# Altium project aymed_balloon.PrjPcb
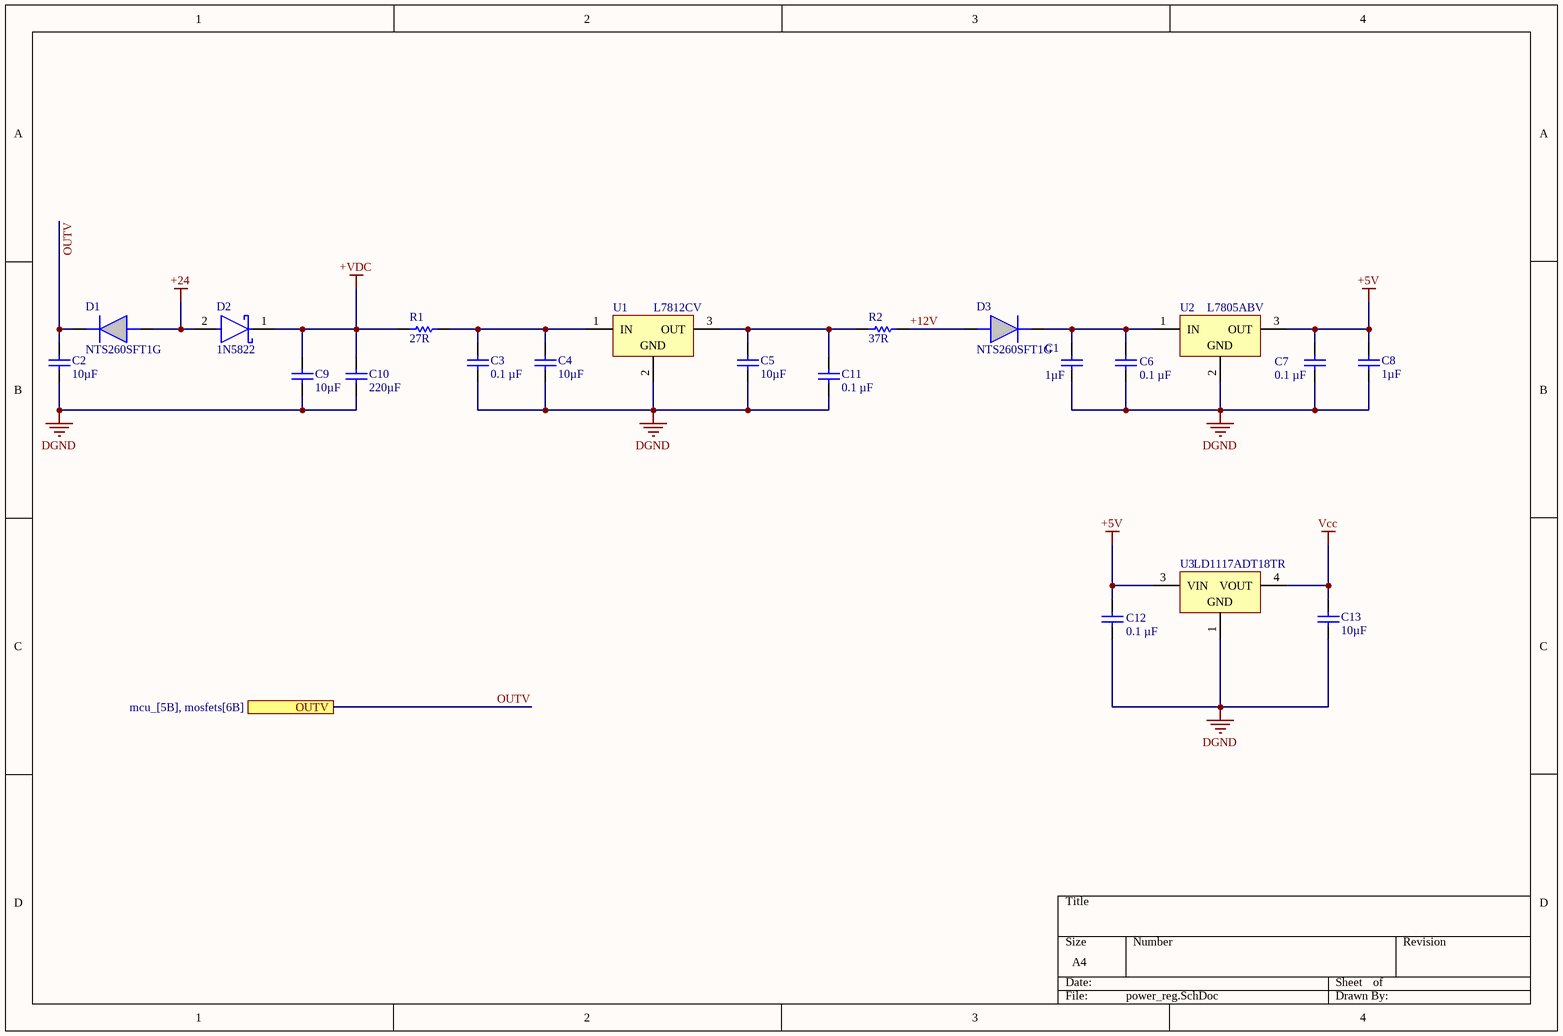
[diagram p0: power_reg.SchDoc]
3 sheets, 116 parts. Net scope: flat (ports and power ports of the same name join across sheets).
Board file: pcb.PcbDoc
Sheets:
  power_reg.SchDoc
  mcu_.SchDoc
  mosfets.SchDoc

## Sheet power_reg.SchDoc
size A4; SheetNumber: 1; SheetTotal: 3

### Parts
C1  Capacitance: 1µF  [0603cap]  (hidden comment: CAP CER 1UF 25V X7R 0603)
C2  Capacitance: 10µF  [CAPC2012X140N - duplicate]  (hidden comment: CAP CER 10UF 25V X5R 0805)
C3  Capacitance: 0.1 µF  [0603cap]  (hidden comment: CAP CER 0.1UF 25V X7R 0603)
C4  Capacitance: 10µF  [0603cap]  (hidden comment: CAP CER 10UF 25V X5R 0805)
C5  Capacitance: 10µF  [CAPC2012X140N - duplicate]  (hidden comment: CAP CER 10UF 25V X5R 0805)
C6  Capacitance: 0.1 µF  [0603cap]  (hidden comment: CAP CER 0.1UF 25V X7R 0603)
C7  Capacitance: 0.1 µF  [0603cap]  (hidden comment: CAP CER 0.1UF 25V X7R 0603)
C8  Capacitance: 1µF  [0603cap]  (hidden comment: CAP CER 1UF 25V X7R 0603)
C9  Capacitance: 10µF  [CAPC2012X140N - duplicate]  (hidden comment: CAP CER 10UF 25V X5R 0805)
C10  Capacitance: 220µF  [CAPC2012X140N - duplicate]  (hidden comment: CAP CER 10UF 25V X5R 0805)
C11  Capacitance: 0.1 µF  [0603cap]  (hidden comment: CAP CER 0.1UF 25V X7R 0603)
C12  Capacitance: 0.1 µF  [0603cap]  (hidden comment: CAP CER 0.1UF 25V X7R 0603)
C13  Capacitance: 10µF  [CAPC2012X140N]  (hidden comment: CAP CER 10UF 25V X5R 0805)
D1  NTS260SFT1G  [SODFL3616X98N]
D2  1N5822  [FP-DO-201AD-MFG]
D3  NTS260SFT1G  [SODFL3616X98N]
R1  Resistance: 27R  [0603 RES]  (hidden comment: RC0603JR-0727RL)
R2  Resistance: 37R  [0603 RES]  (hidden comment: RC0603JR-0727RL)
U1  L7812CV  [TO220]
U2  L7805ABV  [TO220]
U3  LD1117ADT18TR  [TO-252_N]

### Ports
OUTV (see mcu_[5B], mosfets[6B])

### Nets
+5V: C7.2 C8.2 C12.2 U2.3(OUT) U3.3(VIN)
+24: D1.2(A) D2.2(A)
+VDC: C9.2 C10.2 D2.1(C) R1.1
DGND: C1.1 C2.1 C3.1 C4.1 C5.1 C6.1 C7.1 C8.1 C9.1 C10.1 C11.1 C12.1 C13.1 U1.2(GND) U2.2(GND) U3.1(GND)  [project net MCU_BZR]
Vcc: C13.2 U3.4(VOUT)  [project net +3V3]
+12V: D3.2(A) R2.1
OUTV: C2.2 D1.1(K) ; port OUTV
NetC1_2: C1.2 C6.2 D3.1(K) U2.1(IN)
NetC3_2: C3.2 C4.2 R1.2 U1.1(IN)
NetC5_2: C5.2 C11.2 R2.2 U1.3(OUT)

### Library data of the parts
C1 C8 = CAP CER 1UF 25V X7R 0603: 1 µF ±10% 25V Ceramic Capacitor X7R 0603 (1608 Metric); Manufacturer: Samsung Electro-Mechanics; Manufacturer PN: CL10B105KA8NNNC; Supplier PN: 1276-1184-1-ND; Supplier: Digikey; Supplier 1: Digi-Key; Supplier Part Number 1: 1276-1184-1-ND
C2 C4 C5 C9 C10 C13 = CAP CER 10UF 25V X5R 0805: 10 µF ±20% 25V Ceramic Capacitor X5R 0805 (2012 Metric); Supplier 1: Digi-Key; Supplier Part Number 1: 490-10748-1-ND
C3 C6 C7 C11 C12 = CAP CER 0.1UF 25V X7R 0603: 0.1 µF ±5% 25V Ceramic Capacitor X7R 0603 (1608 Metric); Manufacturer PN: C0603C104J3RACAUTO; Supplier 1: Digi-Key; Supplier Part Number 1: 399-12996-1-ND; Supplier PN: 399-12996-1-ND
D1 D3 = NTS260SFT1G: Fine Lithography Trenchbased Schottky Technology for Very Low Forward Voltage and Low Leakage; Fast Switching with Exceptional Temperature Stability; Low Power Loss and Lower Operating Temperature; Higher Efficiency for Achieving Regulatory Compliance; Low Thermal Resistance; High Surge Capability; These are PbFree and HalideFree Devices; Manufacturer_Name: onsemi; Geometry.Height: 0.98mm; Manufacturer_Part_Number: NTS260SFT1G; Mouser Part Number: 863-NTS260SFT1G; Mouser Price/Stock: https://www.mouser.co.uk/ProductDetail/onsemi/NTS260SFT1G?qs=k6dkFvHqcvCML1heMZjMng%3D%3D; Arrow Part Number: NTS260SFT1G; Arrow Price/Stock: https://www.arrow.com/en/products/nts260sft1g/on-semiconductor; Datasheet Link: https://www.onsemi.com/pub/Collateral/NTS260SF-D.PDF
D2 = CMP-12187-000025-1: DIODE SCHOTTKY 40V 3A DO201AD; Manufacturer: STMicroelectronics; Max Junction Temp: +150°C; Peak Reverse Current: 2mA; Max Surge Forward Current: 80A; Temperature Range High: +150°C; Automotive: No; RoHS: TRUE; ComponentLink2Description: Datasheet; Manufacturer Part Number: 1N5822; Lead Free: Yes; Octopart: https://octopart.com/1n5822-stmicroelectronics-323225; Device Class L2: Diodes; Max Repetitive Reverse Voltage: 40V; Temperature: to +150°C; Height: 5.3mm; Category: Diode; Digikey Description: DIODE SCHOTTKY 40V 3A DO201AD; ComponentLink2URL: https://www.st.com/resource/en/datasheet/1n5822.pdf; Device Class L3: Schottky Diodes; Device Class L1: Discrete Semiconductors; Forward Current: 3A; Mouser Description: Schottky Diodes & Rectifiers Vr/40V Io/3A BULK; Package: DO-201AD
R1 R2 = RES 27 OHM 5% 1/10W 0603: Manufacturer: YAGEO; Supplier PN: 311-27GRCT-ND; Supplier: DIGIKEY; ComponentLink1Description: Supplier Link; ComponentLink1URL: 0R; Manufacturer PN: RC0603JR-0727RL; Supplier 1: Digi-Key; Supplier Part Number 1: 311-27GRCT-ND
U1 = CMP-0244-00450-1: Positive Voltage Regulator, 12V, 3-Pin TO-220; PackageDescription: TO, Thru-Hole, Vertical, Heatsink Mounted; 3 In-Line Leads; Pitch 2.54 mm; ComponentLink3URL: http://www.st.com/internet/com/TECHNICAL_RESOURCES/TECHNICAL_LITERATURE/PACKAGE_INFORMATION/CD00004649.pdf; ComponentLink1URL: http://www.st.com; ComponentLink2Description: Datasheet; ComponentLink3Description: Package Specification; ComponentLink2URL: http://www.st.com/internet/com/TECHNICAL_RESOURCES/TECHNICAL_LITERATURE/DATASHEET/CD00000444.pdf; DatasheetVersion: 16/11/2011; PackageVersion: ver3.0; PackageReference: TO220; ComponentLink1Description: Manufacturer URL
U2 = CMP-0244-00485-1: Positive Voltage Regulator, 5V, 3-Pin TO-220; ComponentLink1URL: http://www.st.com; PackageDescription: TO, Thru-Hole, Vertical, Heatsink Mounted; 3 In-Line Leads; Pitch 2.54 mm; DatasheetVersion: 16/11/2011; ComponentLink2Description: Datasheet; ComponentLink1Description: Manufacturer URL; PackageReference: TO220; ComponentLink3Description: Package Specification; ComponentLink2URL: http://www.st.com/internet/com/TECHNICAL_RESOURCES/TECHNICAL_LITERATURE/DATASHEET/CD00000444.pdf; ComponentLink3URL: http://www.st.com/internet/com/TECHNICAL_RESOURCES/TECHNICAL_LITERATURE/PACKAGE_INFORMATION/CD00004649.pdf; PackageVersion: ver3.0
U3 = CMP-0244-00136-1: 1A, Low Drop Positive Voltage Regulator, 1.8V, 3-Pin DPAK, Tape and Reel; DatasheetVersion: 2/12/2011; ComponentLink1Description: Manufacturer URL; ComponentLink1URL: http://www.st.com; ComponentLink2Description: Datasheet; PackageVersion: 2011; ComponentLink2URL: http://www.st.com/internet/com/TECHNICAL_RESOURCES/TECHNICAL_LITERATURE/DATASHEET/CD00002116.pdf; PackageReference: TO-252; PackageDescription: 3-Pin Transistor Outline Package 2.28 mm Pitch, 9.7 mm Lead Span (DPAK)

## Sheet mcu_.SchDoc
size A3; SheetNumber: 2; SheetTotal: 3
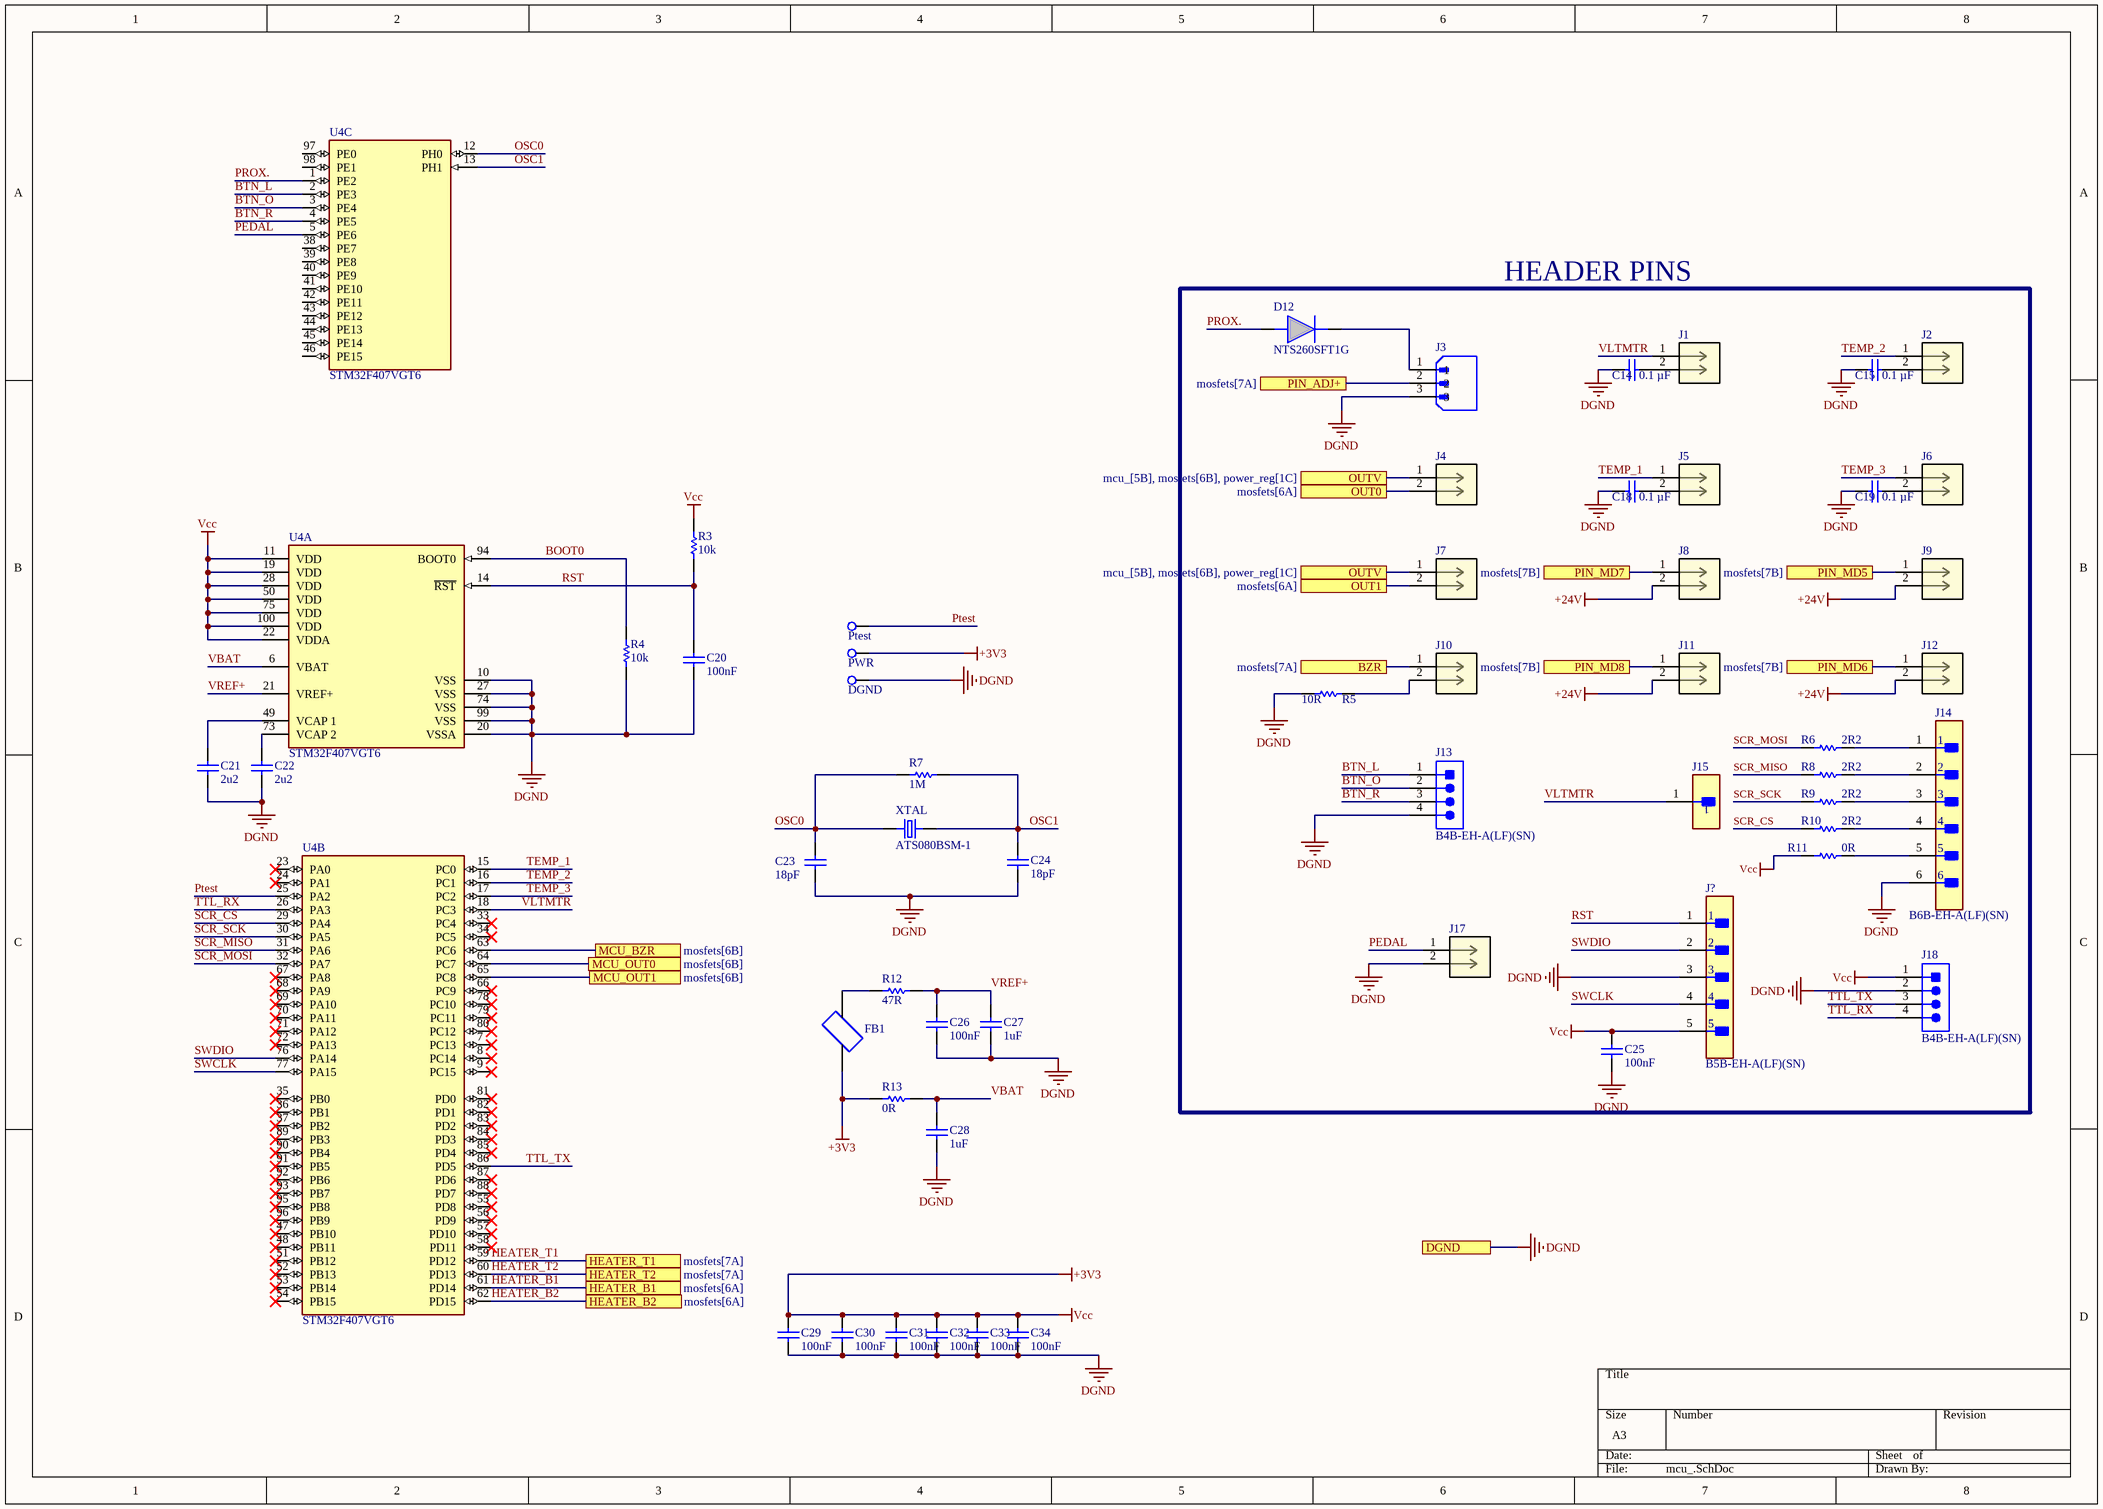
[diagram p1: mcu_.SchDoc]

### Parts
C14  Capacitance: 0.1 µF  [0603cap]  (hidden comment: CAP CER 0.1UF 25V X7R 0603)
C15  Capacitance: 0.1 µF  [0603cap]  (hidden comment: CAP CER 0.1UF 25V X7R 0603)
C18  Capacitance: 0.1 µF  [0603cap]  (hidden comment: CAP CER 0.1UF 25V X7R 0603)
C19  Capacitance: 0.1 µF  [0603cap]  (hidden comment: CAP CER 0.1UF 25V X7R 0603)
C20  Capacitance: 100nF  [0603 CAP]  (hidden comment: C0603C104K5RAC7867)
C21  Capacitance: 2u2  [0603cap]  (hidden comment: JMK107ABJ106MA-T)
C22  Capacitance: 2u2  [0603cap]  (hidden comment: JMK107ABJ106MA-T)
C23  Capacitance: 18pF  [0603 CAP]  (hidden comment: GCM1885C2A160JA16D)
C24  Capacitance: 18pF  [0603 CAP]  (hidden comment: GCM1885C2A160JA16D)
C25  Capacitance: 100nF  [0603 CAP]  (hidden comment: C0603C104K5RAC7867)
C26  Capacitance: 100nF  [0603 CAP]  (hidden comment: C0603C104K5RAC7867)
C27  Capacitance: 1uF  [0603 CAP]  (hidden comment: 1 µF ±10% 25V Ceramic Capacitor X5R 0603)
C28  Capacitance: 1uF  [0603 CAP]  (hidden comment: 1 µF ±10% 25V Ceramic Capacitor X5R 0603)
C29  Capacitance: 100nF  [0603 CAP]  (hidden comment: C0603C104K5RAC7867)
C30  Capacitance: 100nF  [0603 CAP]  (hidden comment: C0603C104K5RAC7867)
C31  Capacitance: 100nF  [0603 CAP]  (hidden comment: C0603C104K5RAC7867)
C32  Capacitance: 100nF  [0603 CAP]  (hidden comment: C0603C104K5RAC7867)
C33  Capacitance: 100nF  [0603 CAP]  (hidden comment: C0603C104K5RAC7867)
C34  Capacitance: 100nF  [0603 CAP]  (hidden comment: C0603C104K5RAC7867)
D12  NTS260SFT1G  [SODFL3616X98N]
DGND  (no value)  [TEST POINT]
FB1  BLM18AG601SN1D  [0603cap]  (value not drawn)
J1  JST CONN HEADER VERT 2POS 2.5MM  [CONN_B2B-EH-A (LF)(SN)_JST]  (value not drawn)
J2  JST CONN HEADER VERT 2POS 2.5MM  [CONN_B2B-EH-A (LF)(SN)_JST]  (value not drawn)
J3  JST CONN HEADER VERT 3POS 2.5MM  [JST_B3B-XH-A(LF)(SN)]  (value not drawn)
J4  JST CONN HEADER VERT 2POS 2.5MM  [CONN_B2B-EH-A (LF)(SN)_JST]  (value not drawn)
J5  JST CONN HEADER VERT 2POS 2.5MM  [CONN_B2B-EH-A (LF)(SN)_JST]  (value not drawn)
J6  JST CONN HEADER VERT 2POS 2.5MM  [CONN_B2B-EH-A (LF)(SN)_JST]  (value not drawn)
J7  JST CONN HEADER VERT 2POS 2.5MM  [CONN_B2B-EH-A (LF)(SN)_JST]  (value not drawn)
J8  JST CONN HEADER VERT 2POS 2.5MM  [CONN_B2B-EH-A (LF)(SN)_JST]  (value not drawn)
J9  JST CONN HEADER VERT 2POS 2.5MM  [CONN_B2B-EH-A (LF)(SN)_JST]  (value not drawn)
J10  JST CONN HEADER VERT 2POS 2.5MM  [CONN_B2B-EH-A (LF)(SN)_JST]  (value not drawn)
J11  JST CONN HEADER VERT 2POS 2.5MM  [CONN_B2B-EH-A (LF)(SN)_JST]  (value not drawn)
J12  JST CONN HEADER VERT 2POS 2.5MM  [CONN_B2B-EH-A (LF)(SN)_JST]  (value not drawn)
J13  B4B-EH-A(LF)(SN)  [JST-B4B-EH-A_V]
J14  B6B-EH-A(LF)(SN)  [FP-B6B-EH-A_LF_SN-MFG]
J15  TSW-101-07-L-S  [FP-TSW-101-07-L-S-MFG]  (value not drawn)
J17  JST CONN HEADER VERT 2POS 2.5MM  [CONN_B2B-EH-A (LF)(SN)_JST]  (value not drawn)
J18  B4B-EH-A(LF)(SN)  [JST-B4B-EH-A_V]
J?  B5B-EH-A(LF)(SN)  [FP-B5B-EH-A_LF_SN-MFG]
Ptest  (no value)  [TEST POINT]
PWR  (no value)  [TEST POINT]
R3  Resistance: 10k  [0603RES]  (hidden comment: Res  0603 10K Ohm 1% 1/10W)
R4  Resistance: 10k  [0603RES]  (hidden comment: Res  0603 10K Ohm 1% 1/10W)
R5  Resistance: 10R  [0603RES]  (hidden comment: Res  0603 10K Ohm 1% 1/10W)
R6  Resistance: 2R2  [0603RES]  (hidden comment: 2.2R Ohms Jumper Chip Resistor 0603)
R7  Resistance: 1M  [0603RES]  (hidden comment: TC0325F1004T5F)
R8  Resistance: 2R2  [0603RES]  (hidden comment: 2.2R Ohms Jumper Chip Resistor 0603)
R9  Resistance: 2R2  [0603RES]  (hidden comment: 2.2R Ohms Jumper Chip Resistor 0603)
R10  Resistance: 2R2  [0603RES]  (hidden comment: 2.2R Ohms Jumper Chip Resistor 0603)
R11  Resistance: 0R  [0603RES]  (hidden comment: 0 Ohms Jumper Chip Resistor 0603)
R12  Resistance: 47R  [0603RES]  (hidden comment: CQ03SAF470JT5E)
R13  Resistance: 0R  [0603RES]  (hidden comment: 0 Ohms Jumper Chip Resistor 0603)
U4  STM32F407VGT6  [FP-LQFP100-1L-MFG]  (parts A,B,C of 3)
XTAL  ATS080BSM-1  [ATS080BSM-1]

### Ports
BZR (see mosfets[7A]), DGND, HEATER_B1 (see mosfets[6A]), HEATER_B2 (see mosfets[6A]), HEATER_T1 (see mosfets[7A]), HEATER_T2 (see mosfets[7A]), MCU_BZR (see mosfets[6B]), MCU_OUT0 (see mosfets[6B]), MCU_OUT1 (see mosfets[6B]), OUT0 (see mosfets[6A]), OUT1 (see mosfets[6A]), OUTV (see mcu_[5B], mosfets[6B], power_reg[1C]), PIN_ADJ+ (see mosfets[7A]), PIN_MD5 (see mosfets[7B]), PIN_MD6 (see mosfets[7B]), PIN_MD7 (see mosfets[7B]), PIN_MD8 (see mosfets[7B])

### Nets
+3V3: C25.1 C29.1 C30.1 C31.1 C32.1 C33.1 C34.1 FB1.1 J18.1 J?.5 PWR.1(TP) R3.2 R11.1 R13.1 U4.11(VDD) U4.19(VDD) U4.22(VDDA) U4.28(VDD) U4.50(VDD) U4.75(VDD) U4.100(VDD)  [also labelled Vcc]
\: J4.2 J7.2 J8.2 J9.2 J10.2 J11.2 J12.2 R5.1 ; port OUT0, port OUT1  [also labelled +24V]
DGND: C14.1 C15.1 C18.1 C19.1 C20.2 C21.2 C22.2 C23.2 C24.2 C25.2 C26.2 C27.2 C28.2 C29.2 C30.2 C31.2 C32.2 C33.2 C34.2 DGND.1(TP) J3.3 J13.4 J14.6 J17.2 J18.2 J?.3 R4.1 R5.2 U4.10(VSS) U4.20(VSSA) U4.27(VSS) U4.63(PC6) U4.74(VSS) U4.99(VSS) ; port MCU_BZR, port DGND  [project net MCU_BZR]
BOOT0: R4.2 U4.94(BOOT0)
BTN_L: J13.1 U4.2(PE3)
BTN_O: J13.2 U4.3(PE4)
BTN_R: J13.3 U4.4(PE5)
BZR: J10.1 ; port BZR
HEATER_B1: U4.61(PD14) ; port HEATER_B1
HEATER_B2: U4.62(PD15) ; port HEATER_B2
HEATER_T1: U4.59(PD12) ; port HEATER_T1
HEATER_T2: U4.60(PD13) ; port HEATER_T2
MCU_OUT0: U4.64(PC7) ; port MCU_OUT0
MCU_OUT1: U4.65(PC8) ; port MCU_OUT1
MD5: J9.1 ; port PIN_MD5
MD6: J12.1 ; port PIN_MD6
MD7: J8.1 ; port PIN_MD7
MD8: J11.1 ; port PIN_MD8
OSC0: C23.1 R7.2 U4.12(PH0) XTAL.1
OSC1: C24.1 R7.1 U4.13(PH1) XTAL.2
OUTV: J4.1 J7.1 ; port OUTV
PEDAL: J17.1 U4.5(PE6)
PIN_ADJ+: J3.2 ; port PIN_ADJ+
PROX.: D12.2(A) U4.1(PE2)
Ptest: Ptest.1(TP) U4.25(PA2)
RST: C20.1 J?.1 R3.1 U4.14(~{RST})
SCR_CS: R10.1 U4.29(PA4)
SCR_MISO: R8.1 U4.31(PA6)
SCR_MOSI: R6.1 U4.32(PA7)
SCR_SCK: R9.1 U4.30(PA5)
SWCLK: J?.4 U4.77(PA15)
SWDIO: J?.2 U4.76(PA14)
TEMP_1: J5.1 U4.15(PC0)
TEMP_2: J2.1 U4.16(PC1)
TEMP_3: J6.1 U4.17(PC2)
TTL_RX: J18.4 U4.26(PA3)
TTL_TX: J18.3 U4.86(PD5)
VBAT: C28.1 R13.2 U4.6(VBAT)
VLTMTR: J1.1 J15.1 U4.18(PC3)
VREF+: C26.1 C27.1 R12.1 U4.21(VREF+)
NetC14_2: C14.2 J1.2
NetC15_2: C15.2 J2.2
NetC18_2: C18.2 J5.2
NetC19_2: C19.2 J6.2
NetC21_1: C21.1 U4.49(VCAP_1)
NetC22_1: C22.1 U4.73(VCAP_2)
NetD12_1: D12.1(K) J3.1
NetFB1_2: FB1.2 R12.2
NetJ14_1: J14.1 R6.2
NetJ14_2: J14.2 R8.2
NetJ14_3: J14.3 R9.2
NetJ14_4: J14.4 R10.2
NetJ14_5: J14.5 R11.2

Not connected (* = marked no-connect by the designer): U4 7(PC13)* 8(PC14)* 9(PC15)* 23(PA0)* 24(PA1)* 33(PC4)* 34(PC5)* 35(PB0)* 36(PB1)* 37(PB2)* 38(PE7) 39(PE8) 40(PE9) 41(PE10) 42(PE11) 43(PE12) 44(PE13) 45(PE14) 46(PE15) 47(PB10)* 48(PB11)* 51(PB12)* 52(PB13)* 53(PB14)* 54(PB15)* 55(PD8)* 56(PD9)* 57(PD10)* 58(PD11)* 66(PC9)* 67(PA8)* 68(PA9)* 69(PA10)* 70(PA11)* 71(PA12)* 72(PA13)* 78(PC10)* 79(PC11)* 80(PC12)* 81(PD0)* 82(PD1)* 83(PD2)* 84(PD3)* 85(PD4)* 87(PD6)* 88(PD7)* 89(PB3)* 90(PB4)* 91(PB5)* 92(PB6)* 93(PB7)* 95(PB8)* 96(PB9)* 97(PE0) 98(PE1)

### Notes on the sheet
- HEADER PINS

### Library data of the parts
C14 C15 C18 C19 = CAP CER 0.1UF 25V X7R 0603: as C3 on sheet power_reg; Supplier 1: Digi-Key; Supplier Part Number 1: 399-12996-1-ND; Supplier PN: 399-12996-1-ND
C20 C25 C26 C29-C34 = C0603C104K5RAC7867: Ceramic Capacitors  SMD 50volts 0.1uF X7R 10%; Supplier: OZDISAN; ComponentLink1Description: Supplier Link
  C20 C25 C26 C31-C34: Supplier PN: CL10B104KB8NNNC; ComponentLink1URL: https://www.ozdisan.com/pasif-komponentler/kondansatorler/smt-smd-ve-mlcc-kondansatorler/CL10B104KB8NNNC
  C29 C30: Supplier PN: CL10A105KO8NNNC; ComponentLink1URL: https://www.ozdisan.com/pasif-komponentler/kondansatorler/smt-smd-ve-mlcc-kondansatorler/CL10A105KO8NNNC
C21 C22 = GRM188R61E225KA12D: 2.2 µF ±10% 25V Ceramic Capacitor X5R 0603; Manufacturer: Murata; Designed By: Baran; ComponentLink1Description: https://datasheet.ciiva.com/22706/1747460-22706787.pdf?src-supplier=Element14; ComponentLink1URL: https://datasheet.ciiva.com/22706/1747460-22706787.pdf?src-supplier=Element14; Supplier 1: Digi-Key; Manufacturer Part Number: GRM188R61E225KA12D; RoHS: Yes; Category: Ceramic Capacitors; Stock 1: 503975; Pricing 1: 1=0.17000, 10=0.12200, 50=0.06940, 100=0.05750, 500=0.04034, 1000=0.03339 (USD); Mount: Surface Mount; Case/Package: 0603; Number of Pins: 2; Case Code (Metric): 1608; Case Code (Imperial): 0603; Material: Ceramic; Weight: 0.000222oz; Min Operating Temperature: -55°C; Max Operating Temperature: 85°C; Tolerance: 10%; Dielectric: X5R; Voltage Rating: 25V; Packaging: Tape and Reel; Voltage: 25V; Termination: SMD/SMT; Resistor Type: Ceramic; Voltage Rating (DC): 25V; Package Quantity: 4000; Series: GRM; Construction: Flat; Length: 1.6mm; Width: 0.8mm; Height: 0.8mm; Thickness: 0.035inch; Depth: 0.8mm; Radiation Hardening: No; REACH SVHC: No SVHC; Lead Free: Lead Free; RoHS Compliant: Yes; ComponentLink2URL: https://datasheet.ciiva.com/7719/1747460-7719045.pdf?src-supplier=Element14; ComponentLink2Description: https://datasheet.ciiva.com/7719/1747460-7719045.pdf?src-supplier=Element14; ComponentLink3URL: https://datasheet.ciiva.com/14116/grmseries-highdielectrictype-eng-14116409.pdf?src-supplier=Distrelec; ComponentLink3Description: https://datasheet.ciiva.com/14116/grmseries-highdielectrictype-eng-14116409.pdf?src-supplier=Distrelec; Supplier Part Number 1: 490-10731-1-ND
C23 C24 = C0603C104K5RAC7867: 18 pF ±5% 50V Ceramic Capacitor C0G, NP0 0603 (1608 Metric); Supplier PN: CL10C180JB81PNC; Supplier: OZDISAN; ComponentLink1Description: Supplier Link; ComponentLink1URL: https://www.ozdisan.com/pasif-komponentler/kondansatorler/smt-smd-ve-mlcc-kondansatorler/CL10C180JB81PNC
C27 C28 = C0603C104K5RAC7867: Supplier PN: CL10A105KO8NNNC; Supplier: OZDISAN; ComponentLink1Description: Supplier Link; ComponentLink1URL: https://www.ozdisan.com/pasif-komponentler/kondansatorler/smt-smd-ve-mlcc-kondansatorler/CL10A105KO8NNNC
D12 = NTS260SFT1G: as D1 on sheet power_reg; Manufacturer_Part_Number: NTS260SFT1G; Mouser Part Number: 863-NTS260SFT1G; Mouser Price/Stock: https://www.mouser.co.uk/ProductDetail/onsemi/NTS260SFT1G?qs=k6dkFvHqcvCML1heMZjMng%3D%3D; Arrow Part Number: NTS260SFT1G; Arrow Price/Stock: https://www.arrow.com/en/products/nts260sft1g/on-semiconductor; Datasheet Link: https://www.onsemi.com/pub/Collateral/NTS260SF-D.PDF
DGND PWR = Test Point_2: PROBE PAD; ComponentLink1Description: Datasheet; Type: PC Test Point; Mounting Type: Surface Mount
FB1 = FBMH1608HM102-TV: FERRITE BEAD 0603 600R 500MA MURATA; Test Frequency: 100MHz; Impedance: 600R; Max. Current: 500mA; Supplier PN: BLM18AG601SN1D; Supplier: OZDISAN; ComponentLink1Description: Supplier Link; ComponentLink1URL: https://www.ozdisan.com/pasif-komponentler/induktorler/bead-feritler/BLM18AG601SN1D
J1 J2 J4-J12 J17 = B2B-EH-A (LF)(SN): Connector Header Through Hole 2 position 0.098" (2.50mm); Copyright: Copyright (C) 2023 Ultra Librarian. All rights reserved.; Mfr_Name: JST; Manufacturer_Part_Number: B2B-EH-A (LF)(SN); Digi-Key_Part_Number_1: 455-1611-ND; RefDes: RefDes; Type: DEV; Supplier PN: 455-1611-ND; Manufacturer PN: B2B-EH-A(LF)(SN)
J3 = B3B-XH-A(LF)(SN): Connector Header Through Hole 3 position 0.098" (2.50mm); MF: JST Sales; Check_prices: https://www.snapeda.com/parts/B3B-XH-A(LF)(SN)/JST+Sales+America+Inc./view-part/?ref=eda; Value: *; Availability: In Stock; MP: B3B-XH-A(LF)(SN); Price: None; Package: None; SnapEDA_Link: https://www.snapeda.com/parts/B3B-XH-A(LF)(SN)/JST+Sales+America+Inc./view-part/?ref=snap; Purchase-URL: https://pricing.snapeda.com/search/part/B3B-XH-A(LF)(SN)/?ref=eda; Manufacturer PN: B3B-XH-A(LF)(SN); Supplier PN: 455-2248-ND
J13 J18 = CMP-2000-05904-1: Male Header, Pitch 2.5 mm, 1 x 4 Position, Height 6 mm, Tail Length 3.2 mm, -25 to 85 degC, RoHS, Bulk; Manufacturer: JST; Style/Orientation: StraightHeader/Plug; Pitch: 2.5mm; No of Positions: 4; Mounting Technology: SurfaceMount; Package Description: Male Header, Pitch 2.5 mm, 1 x 4 Position, Height 6 mm, Tail Length 3.2 mm; Datasheet Version: 12/2012; Type: ShroudedHeader; Package Reference: B4B-EH-A; Manufacturer URL: http://www.jst.com/home2.html; Termination: Crimp; Datasheet URL: http://www.jst-mfg.com/product/pdf/eng/eEH.pdf
J14 = CMP-17439-000293-1: CONN HEADER VERT 6POS 2.5MM; Voltage Rating: 250V; Number of Positions: 6; Current Rating: 3A; Mated Stacking Heights: 8.1mm; Gender: Male; Insulation Material: Nylon; Number of Contacts: 6; Contact Plating: Tin; Pitch: 2.5mm; Orientation: Straight; Insulation Color: Natural; Packaging: Bulk; Termination: Solder; Flammability Rating: UL94 V-0; Lead Free: Lead Free; Contact Mating Length: 0.13inch; Color: Natural; Contact Finish - Mating: TIN; Connector Type: Header; Contact Shape: Square; Contact Type: Male Pin; Series: EH; Contact Material: Brass; Fastening Type: Friction; Number of Rows: 1; Mount: Through Hole; Housing Color: White
J15 = CMP-02766-001775-1: CONN HEADER VERT 1POS; Gender: Male; Number of Contacts: 1; Max Current Rating: 7.6A; Max Voltage Rating (AC): 550V; RoHS Compliant: Yes; Contact Finish - Mating: GOLD; Length: 2.54mm; Series: TSW; Insulation Material: PBT; Reach SVHC Compliant: Yes; Radiation Hardening: No; Contact Plating: Gold; Termination: Solder; Contact Type: Male Pin; Orientation: Straight; Number of Rows: 1; Depth: 2.54mm; Housing Material: Polyester; Lead Free: Lead Free; Fastening Type: Pull; Flammability Rating: UL94 V-0; Mount: Through Hole; Housing Color: Black; Contact Shape: Square; Min Operating Temperature: -55°C; Connector Type: Header; Contact Mating Length: 0.23inch; Width: 2.54mm; Packaging: Bulk; Contact Material: Bronze; Max Operating Temperature: 125°C; Number of Positions: 1; Color: Black; Insulation Color: Black
J? = CMP-17439-000382-1: CONN HEADER VERT 5POS 2.5MM; Number of Contacts: 5; Mated Stacking Heights: 8.1mm; Current Rating: 3A; Gender: Male; Voltage Rating: 250V; Lead Free: Lead Free; Fastening Type: Friction; Contact Type: Male Pin; Insulation Color: Natural; Insulation Material: Nylon; Contact Material: Brass; Contact Mating Length: 0.13inch; Pitch: 2.5mm; Number of Positions: 5; Number of Rows: 1; Connector Type: Header; Color: Natural; Contact Shape: Square; Flammability Rating: UL94 V-0; Orientation: Straight; Packaging: Bulk; Mount: Through Hole; Contact Finish - Mating: TIN; Contact Plating: Tin; Series: EH; Termination: Solder; Housing Color: White
Ptest = Test Point_2: Ptest; ComponentLink1Description: Datasheet; Type: PC Test Point; Mounting Type: Surface Mount
R3-R5 = RC0603FR-0710KL: Supplier PN: TC0325B1002T5F; Supplier: OZDISAN; ComponentLink1Description: Supplier Link; ComponentLink1URL: https://www.ozdisan.com/pasif-komponentler/direncler/smt-smd-ve-cip-direncler/TC0325B1002T5F
R6 R8-R11 = RC0603FR-071ML: ComponentLink1Description: Supplier Link
R7 = RC0603FR-0710KL: RES.(1608) 0603 1M Ohms 1% 1/10W 25PPM; Supplier PN: TC0325F1004T5F; Supplier: OZDISAN; ComponentLink1Description: Supplier Link; ComponentLink1URL: https://www.ozdisan.com/pasif-komponentler/direncler/smt-smd-ve-cip-direncler/TC0325F1004T5F
R12 = RC0603FR-07100RL: RES.(1608) 0603 47 Ohms 1% 1/10W AUTOMOTIV; Supplier PN: CQ03SAF470JT5E; Supplier: OZDISAN; ComponentLink1Description: Supplier Link; ComponentLink1URL: https://www.ozdisan.com/pasif-komponentler/direncler/smt-smd-ve-cip-direncler/CQ03SAF470JT5E
R13 = CRCW06030000Z0EAC: Manufacturer: Vishay; Designed By: Baran; Power Rating: 100mW; Supplier 1: Digi-Key; Manufacturer Part Number: CRCW06030000Z0EAC; RoHS: Yes; Category: Chip SMD Resistors; Stock 1: 517672; Pricing 1: 1=0.10000, 10=0.02900, 100=0.01190, 1000=0.00533, 2500=0.00463 (USD); Mount: Surface Mount; Case/Package: Molded; Contact Plating: Tin; Min Operating Temperature: -55°C; Max Operating Temperature: 155°C; Resistor Type: Thick Film; Termination: Wraparound; Length: 1.55mm; Lead Free: Lead Free; RoHS Compliant: Yes; ComponentLink1URL: http://www.vishay.com/docs/28773/crcwce3.pdf?src-supplier=Digi-Key; ComponentLink1Description: http://www.vishay.com/docs/28773/crcwce3.pdf?src-supplier=Digi-Key; Supplier Part Number 1: 541-4012-1-ND
U4 = CMP-0243-00017-5: NexarPartId: 20570110; Manufacturer Package Identifier: 1L_ME_V5; Peripherals: Brown-out Detect/Reset, DMA, I2C, LCD, POR, PWM, WDT; Number of Programmable I/O: 82; Oscillator Type: Internal; Nominal Supply Current: 1.7µA; Number of Timers/Counters: 14; RAM Size: 192kB; Number of D/A Converters: 2; Number of Ethernet Channels: 1; Max Frequency: 168MHz; Number of SPI Channels: 3; Data Bus Width: 32b; Number of ADC Channels: 16; Max Supply Voltage: 3.6V; Number of USART Channels: 4; Interface: CAN, Ethernet, I2C, I2S, IrDA, LIN, SPI, UART, USART, USB; Max Junction Temperature (Tj): 125°C; Core Architecture: ARM Cortex-M4; Watchdog Timer: Yes; Memory Size: 1MB; Memory Type: FLASH; Min Supply Voltage: 1.8V; Number of I/Os: 82; Lead Free: Lead Free; Lifecycle Status: Production; Radiation Hardening: No; Frequency: 168MHz; Max Operating Temperature: 85°C; Height: 1.45mm; Number of Pins: 100; Number of I2C Channels: 3; Number of USB Channels: 1; REACH SVHC: No SVHC; Length: 14.2mm; Ambient Temperature Range High: 85°C; Schedule B: 8542310000, 8542310000; Number of Channels: 16; Number of A/D Converters: 3; Width: 14.2mm; Case/Package: LQFP; Flash Memory Size: 1MB; Min Operating Temperature: -40°C; Address Bus Width: 32b; Number of UART Channels: 2; RoHS: Compliant; Number of PWM Channels: 2

## Sheet mosfets.SchDoc
size A3; SheetNumber: 3; SheetTotal: 3
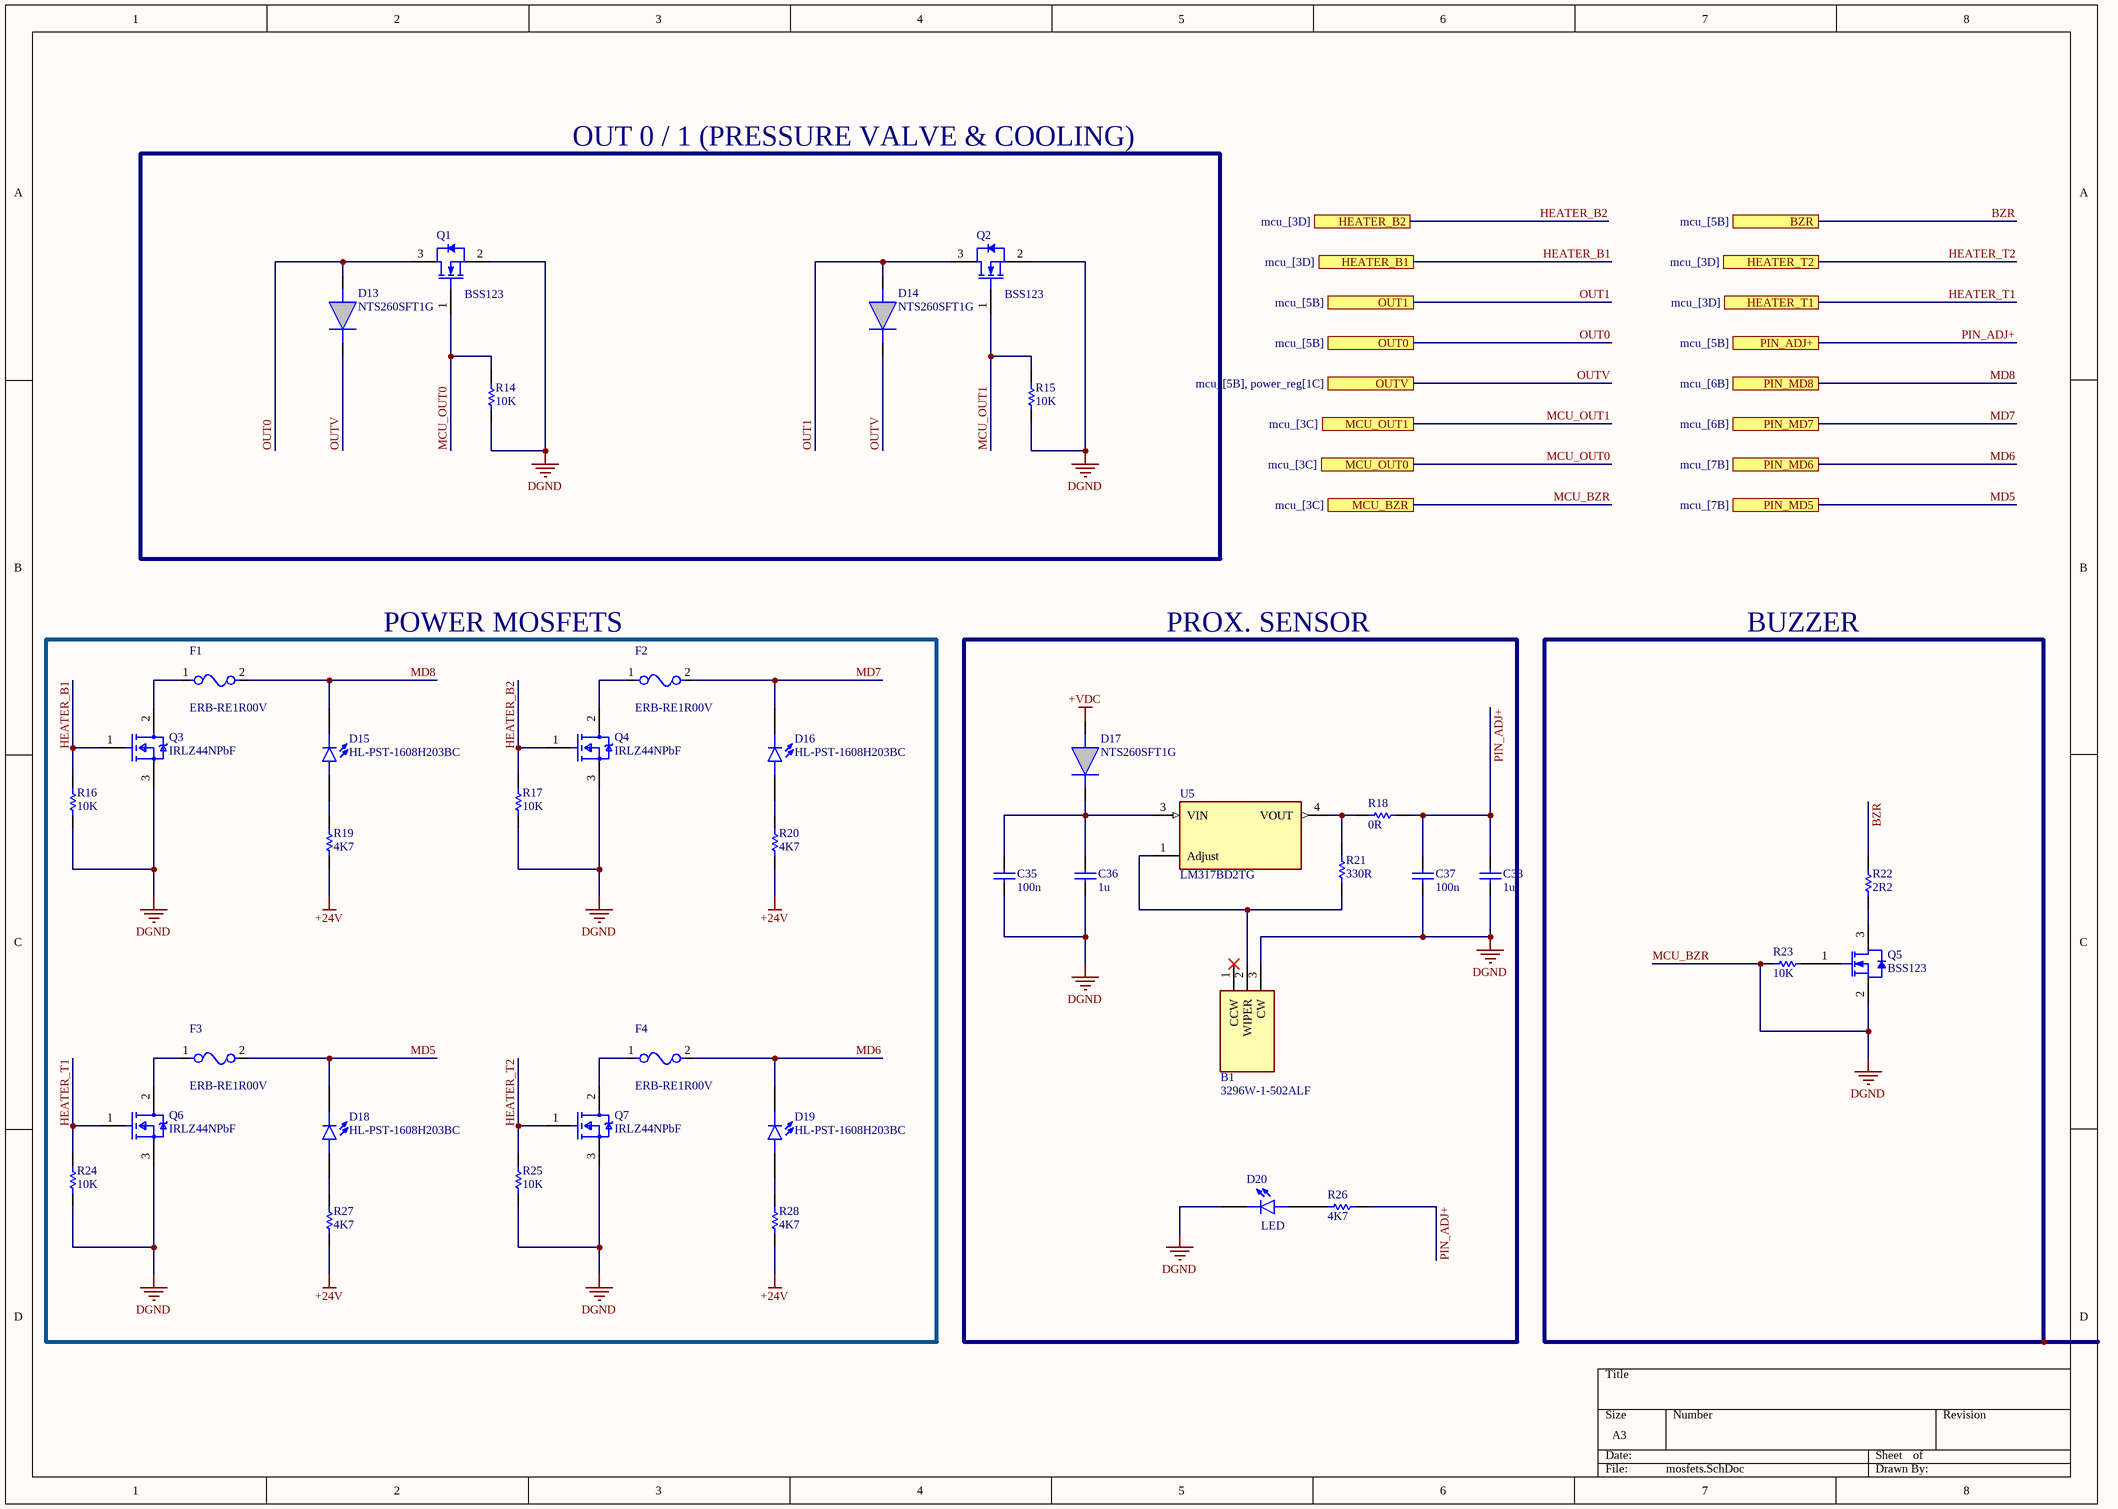
[diagram p2: mosfets.SchDoc]

### Parts
B1  3296W-1-502ALF  [3296W1502ALF]
C35  Capacitance: 100n  [0603 CAP]  (hidden comment: 1 µF ±10% 25V Ceramic Capacitor X5R 0603)
C36  Capacitance: 1u  [0603 CAP]  (hidden comment: 1 µF ±10% 25V Ceramic Capacitor X5R 0603)
C37  Capacitance: 100n  [0603 CAP]  (hidden comment: 1 µF ±10% 25V Ceramic Capacitor X5R 0603)
C38  Capacitance: 1u  [0603 CAP]  (hidden comment: 1 µF ±10% 25V Ceramic Capacitor X5R 0603)
D13  NTS260SFT1G  [SODFL3616X98N]
D14  NTS260SFT1G  [SODFL3616X98N]
D15  HL-PST-1608H203BC  [0603Diode]
D16  HL-PST-1608H203BC  [0603Diode]
D17  NTS260SFT1G  [SODFL3616X98N]
D18  HL-PST-1608H203BC  [0603Diode]
D19  HL-PST-1608H203BC  [0603Diode]
D20  LED  [0603Diode]
F1  ERB-RE1R00V  [FP-ERBRE-MFG]
F2  ERB-RE1R00V  [FP-ERBRE-MFG]
F3  ERB-RE1R00V  [FP-ERBRE-MFG]
F4  ERB-RE1R00V  [FP-ERBRE-MFG]
Q1  BSS123  [FAIR-SOT23-3_V]
Q2  BSS123  [FAIR-SOT23-3_V]
Q3  IRLZ44NPbF  [FP-PG-TO220-3-MFG]
Q4  IRLZ44NPbF  [FP-PG-TO220-3-MFG]
Q5  BSS123  [FAIR-SOT23-3_V]
Q6  IRLZ44NPbF  [FP-PG-TO220-3-MFG]
Q7  IRLZ44NPbF  [FP-PG-TO220-3-MFG]
R14  Resistance: 10K  [0603RES]  (hidden comment: CQ03SAF470JT5E)
R15  Resistance: 10K  [0603RES]  (hidden comment: CQ03SAF470JT5E)
R16  Resistance: 10K  [0603RES]  (hidden comment: CQ03SAF470JT5E)
R17  Resistance: 10K  [0603RES]  (hidden comment: CQ03SAF470JT5E)
R18  Resistance: 0R  [0603RES]  (hidden comment: 0 Ohms Jumper Chip Resistor 0603)
R19  Resistance: 4K7  [0603RES]  (hidden comment: CQ03SAF470JT5E)
R20  Resistance: 4K7  [0603RES]  (hidden comment: CQ03SAF470JT5E)
R21  Resistance: 330R  [0603RES]  (hidden comment: CQ03SAF470JT5E)
R22  Resistance: 2R2  [0603RES]  (hidden comment: CQ03SAF470JT5E)
R23  Resistance: 10K  [0603RES]  (hidden comment: CQ03SAF470JT5E)
R24  Resistance: 10K  [0603RES]  (hidden comment: CQ03SAF470JT5E)
R25  Resistance: 10K  [0603RES]  (hidden comment: CQ03SAF470JT5E)
R26  Resistance: 4K7  [0603RES]  (hidden comment: CQ03SAF470JT5E)
R27  Resistance: 4K7  [0603RES]  (hidden comment: CQ03SAF470JT5E)
R28  Resistance: 4K7  [0603RES]  (hidden comment: CQ03SAF470JT5E)
U5  LM317BD2TG  [FP-936-03-MFG]

### Blocks framed on the sheet
POWER MOSFETS: D15 D16 D18 D19 F1-F4 Q3 Q4 Q6 Q7 R16 R17 R19 R20 R24 R25 R27 R28

### Ports
BZR (see mcu_[5B]), HEATER_B1 (see mcu_[3D]), HEATER_B2 (see mcu_[3D]), HEATER_T1 (see mcu_[3D]), HEATER_T2 (see mcu_[3D]), MCU_BZR (see mcu_[3C]), MCU_OUT0 (see mcu_[3C]), MCU_OUT1 (see mcu_[3C]), OUT0 (see mcu_[5B]), OUT1 (see mcu_[5B]), OUTV (see mcu_[5B], power_reg[1C]), PIN_ADJ+ (see mcu_[5B]), PIN_MD5 (see mcu_[7B]), PIN_MD6 (see mcu_[7B]), PIN_MD7 (see mcu_[6B]), PIN_MD8 (see mcu_[6B])

### Nets
+VDC: D17.2(A)
\: D13.2(A) D14.2(A) Q1.3(D) Q2.3(D) R19.1 R20.1 R27.1 R28.1 ; port OUT0, port OUT1  [also labelled +24V, OUT0, OUT1]
MCU_BZR: B1.3(CW) C35.2 C36.2 C37.2 C38.2 D20.C Q1.2(S) Q2.2(S) Q3.3(S) Q4.3(S) Q5.2(S) Q6.3(S) Q7.3(S) R14.2 R15.2 R16.2 R17.2 R23.2 R24.2 R25.2 ; port MCU_BZR  [also labelled DGND]
BZR: R22.2 ; port BZR
HEATER_B1: Q3.1(G) R16.1 ; port HEATER_B1
HEATER_B2: Q4.1(G) R17.1 ; port HEATER_B2
HEATER_T1: Q6.1(G) R24.1 ; port HEATER_T1
HEATER_T2: Q7.1(G) R25.1 ; port HEATER_T2
MCU_OUT0: Q1.1(G) R14.1 ; port MCU_OUT0
MCU_OUT1: Q2.1(G) R15.1 ; port MCU_OUT1
MD5: D18.C F3.2 ; port PIN_MD5
MD6: D19.C F4.2 ; port PIN_MD6
MD7: D16.C F2.2 ; port PIN_MD7
MD8: D15.C F1.2 ; port PIN_MD8
OUTV: D13.1(K) D14.1(K) ; port OUTV
PIN_ADJ+: C37.1 C38.1 R18.2 R26.1 ; port PIN_ADJ+
NetB1_2: B1.2(WIPER) R21.1 U5.1(Adjust)
NetC35_1: C35.1 C36.1 D17.1(K) U5.3(VIN)
NetD15_A: D15.A R19.2
NetD16_A: D16.A R20.2
NetD18_A: D18.A R27.2
NetD19_A: D19.A R28.2
NetD20_A: D20.A R26.2
NetF1_1: F1.1 Q3.2(D)
NetF2_1: F2.1 Q4.2(D)
NetF3_1: F3.1 Q6.2(D)
NetF4_1: F4.1 Q7.2(D)
NetQ5_1: Q5.1(G) R23.1
NetQ5_3: Q5.3(D) R22.1
NetR18_1: R18.1 R21.2 U5.4(VOUT)

Not connected (* = marked no-connect by the designer): B1 1(CCW)*

### Notes on the sheet
- OUT 0 / 1 (PRESSURE VALVE & COOLING)
- PROX. SENSOR
- BUZZER

### Library data of the parts
B1 = 3296W-1-502ALF: Trimmer Resistors - Through Hole 3/8" 5Kohms Sealed Vertical Adjust; Manufacturer_Name: Bourns; Geometry.Height: 11.8mm; Manufacturer_Part_Number: 3296W-1-502ALF; Mouser Part Number: 652-3296W-1-502ALF; Mouser Price/Stock: https://www.mouser.co.uk/ProductDetail/Bourns/3296W-1-502ALF?qs=2esLye6h6wF9Wpw2gFsopg%3D%3D; Arrow Part Number: 3296W-1-502ALF; Arrow Price/Stock: https://www.arrow.com/en/products/3296w-1-502alf/bourns?utm_currency=USD&region=nac; Datasheet Link: https://www.bourns.com/docs/Product-Datasheets/3296.pdf
C35-C38 = C0603C104K5RAC7867: Supplier PN: CL10A105KO8NNNC; Supplier: OZDISAN; ComponentLink1Description: Supplier Link; ComponentLink1URL: https://www.ozdisan.com/pasif-komponentler/kondansatorler/smt-smd-ve-mlcc-kondansatorler/CL10A105KO8NNNC
D13 D14 D17 = NTS260SFT1G: as D1 on sheet power_reg; Manufacturer_Part_Number: NTS260SFT1G; Mouser Part Number: 863-NTS260SFT1G; Mouser Price/Stock: https://www.mouser.co.uk/ProductDetail/onsemi/NTS260SFT1G?qs=k6dkFvHqcvCML1heMZjMng%3D%3D; Arrow Part Number: NTS260SFT1G; Arrow Price/Stock: https://www.arrow.com/en/products/nts260sft1g/on-semiconductor; Datasheet Link: https://www.onsemi.com/pub/Collateral/NTS260SF-D.PDF
D15 D16 D18-D20 = HL-PST-1608H203BC: LED SMD 0603 BLUE 100mcd 120° WATER CLEAR; Supplier PN: HL-PST-1608H203BC; Supplier: OZDISAN; ComponentLink9Description: Supplier Link; ComponentLink9URL: https://www.ozdisan.com/led-ve-aydinlatma-cozumleri/led-komponentler/sinyal-ledler-renkli/HL-PST-1608H203BC
F1-F4 = CMP-00287-21220537-1: ERB-RE1R00V Fuse Chip Fast Acting 1A 32V SMD Solder Pad 0603 1.6 X 0.8 X 0.54mm T/R UL/cUL; Resistance: 125mΩ; Approvals: UL; Body Material: Alumina; Number of Pins: 2; RoHS: Compliant; Length: 1.6mm; Max Voltage Rating (DC): 32V; REACH SVHC: No SVHC; Case Code (Imperial): 0603; Mount: Surface Mount; Voltage Rating: 32V; Case Code (Metric): 1608; Current Rating: 1A; Width: 800µm; Min Operating Temperature: -40°C; Voltage Rating (DC): 32V; Height: 640µm; Current: 1A; Lead Free: Lead Free; Packaging: Cut Tape; Lifecycle Status: Production; Case/Package: 0603; Max Operating Temperature: 125°C; Fuse Current: 1A; Radiation Hardening: No; Depth: 800µm
Q1 Q2 Q5 = CMP-2000-04934-1: N-Channel Logic Level Enhancement Mode Field Effect Transistor, 1.7 V, -55 to 150 degC, 3-Pin SOT-23, RoHS, Tape and Reel; Manufacturer: Fairchild; Channel Type: N; Typical Turn-Off Delay Time: 17ns; Maximum Continuous Drain Current: 0.17A; Rad Hard: No; Typical Rise Time: 9ns; Typical Fall Time: 2.4ns; Maximum Gate Source Voltage: ±20V; Maximum Drain Source Voltage: 100V; Typical Turn-On Delay Time: 1.7ns; RDS-on: 6000@10VmOhm; Package Version: Rev. 12, 03/2016; Packaging: Tape&Reel; Package Reference: SOT23-3; Channel Mode: Enhancement; Operating Temperature: -55to150degC; Package Description: 3-Pin Small Outline Transistor, Body 2.92 x 1.325 mm, Pitch 0.95 mm; Category: MOSFET; Datasheet Version: Jun-03; Datasheet URL: https://www.fairchildsemi.com/datasheets/BS/BSS123.pdf; Manufacturer URL: https://www.fairchildsemi.com/; Mounting: SurfaceMount; Package: 3SOT-23; Package URL: http://www.fairchildsemi.com/dwg/MA/MA03D.pdf
Q3 Q4 Q6 Q7 = CMP-32901-000488-1: MOSFET N-CH 55V 47A TO220AB; Turn-On Delay Time: 11ns; Gate to Source Voltage (Vgs): 16V; Element Configuration: Single; Rds On Max: 22mR; Turn-Off Delay Time: 26ns; Max Power Dissipation: 110W; Threshold Voltage: 2V; Drain to Source Resistance: 35mR; Input Capacitance: 1.7nF; Continuous Drain Current (ID): 47A; Case/Package: TO-220; Lead Free: Lead Free; Halogen Free: Halogen Free; Packaging: Rail/Tube; Length: 0.414inch; Min Operating Temperature: -55°C; REACH SVHC: No SVHC; Number of Pins: 3; Width: 0.185inch; Drain to Source Voltage (Vdss): 55V; Power Dissipation: 110W; RoHS Compliant: Yes; Max Operating Temperature: 175°C; Height: 0.6inch; Max Dual Supply Voltage: 55V; Drain to Source Breakdown Voltage: 55V; Mount: Through Hole
R14-R17 R19-R28 = RC0603FR-07100RL: as R12 on sheet mcu_; Supplier PN: CQ03SAF470JT5E; Supplier: OZDISAN; ComponentLink1Description: Supplier Link; ComponentLink1URL: https://www.ozdisan.com/pasif-komponentler/direncler/smt-smd-ve-cip-direncler/CQ03SAF470JT5E
R18 = CRCW06030000Z0EAC: as R13 on sheet mcu_; Supplier 1: Digi-Key; Manufacturer Part Number: CRCW06030000Z0EAC; RoHS: Yes; Category: Chip SMD Resistors; Stock 1: 517672; Pricing 1: 1=0.10000, 10=0.02900, 100=0.01190, 1000=0.00533, 2500=0.00463 (USD); Mount: Surface Mount; Case/Package: Molded; Contact Plating: Tin; Min Operating Temperature: -55°C; Max Operating Temperature: 155°C; Resistor Type: Thick Film; Termination: Wraparound; Length: 1.55mm; Lead Free: Lead Free; RoHS Compliant: Yes; ComponentLink1URL: http://www.vishay.com/docs/28773/crcwce3.pdf?src-supplier=Digi-Key; ComponentLink1Description: http://www.vishay.com/docs/28773/crcwce3.pdf?src-supplier=Digi-Key; Supplier Part Number 1: 541-4012-1-ND
U5 = CMP-07128-000010-1: IC REG LINEAR POS ADJ 1.5A D2PAK; Manufacturer: ON Semiconductor; Max Junction Temp: +125°C; Number Of Outputs: 1; Max Supply Voltage: 40V; Standoff Height: 0mm; Output Voltage: 1.2-37V; Output Type: AdjustableProgrammable; Mouser Description: Linear Voltage Regulators 1.5A ADJ 1.2-37V Positive; RoHS: TRUE; Footprint Url: https://www.onsemi.com/pub/Collateral/936-03.PDF; Lead Free: Yes; Height: 4.826mm; ComponentLink2Description: Datasheet; Package: 936-03; Digikey Description: IC REG LINEAR POS ADJ 1.5A D2PAK; Automotive: No; Device Class L1: Integrated Circuits (ICs); Category: IC; Output Current: 1.5A; Device Class L2: Power Management ICs; Manufacturer Part Number: LM317BD2TG; Temperature Range Low: -40°C; Temperature: -40°C to +125°C; Device Class L3: Voltage Regulators - Linear; ComponentLink2URL: https://www.onsemi.com/pub/Collateral/LM317-D.PDF; Temperature Range High: +125°C; Octopart: https://octopart.com/lm317bd2tg-on+semiconductor-1010532

## Nets that join several sheets
+3V3: power_reg (C13.2 U3.4), mcu_ (21 pins)
+VDC: power_reg (C9.2 C10.2 D2.1 R1.1), mosfets (D17.2)
\: mcu_ (8 pins), mosfets (8 pins)
MCU_BZR: power_reg (16 pins), mcu_ (34 pins), mosfets (20 pins)
BZR: mcu_ (J10.1), mosfets (R22.2)
HEATER_B1: mcu_ (U4.61), mosfets (Q3.1 R16.1)
HEATER_B2: mcu_ (U4.62), mosfets (Q4.1 R17.1)
HEATER_T1: mcu_ (U4.59), mosfets (Q6.1 R24.1)
HEATER_T2: mcu_ (U4.60), mosfets (Q7.1 R25.1)
MCU_OUT0: mcu_ (U4.64), mosfets (Q1.1 R14.1)
MCU_OUT1: mcu_ (U4.65), mosfets (Q2.1 R15.1)
MD5: mcu_ (J9.1), mosfets (D18.C F3.2)
MD6: mcu_ (J12.1), mosfets (D19.C F4.2)
MD7: mcu_ (J8.1), mosfets (D16.C F2.2)
MD8: mcu_ (J11.1), mosfets (D15.C F1.2)
OUTV: power_reg (C2.2 D1.1), mcu_ (J4.1 J7.1), mosfets (D13.1 D14.1)
PIN_ADJ+: mcu_ (J3.2), mosfets (C37.1 C38.1 R18.2 R26.1)